# Altium schematic sheet Bank3-4-5_I_O 2.SchDoc
size A3
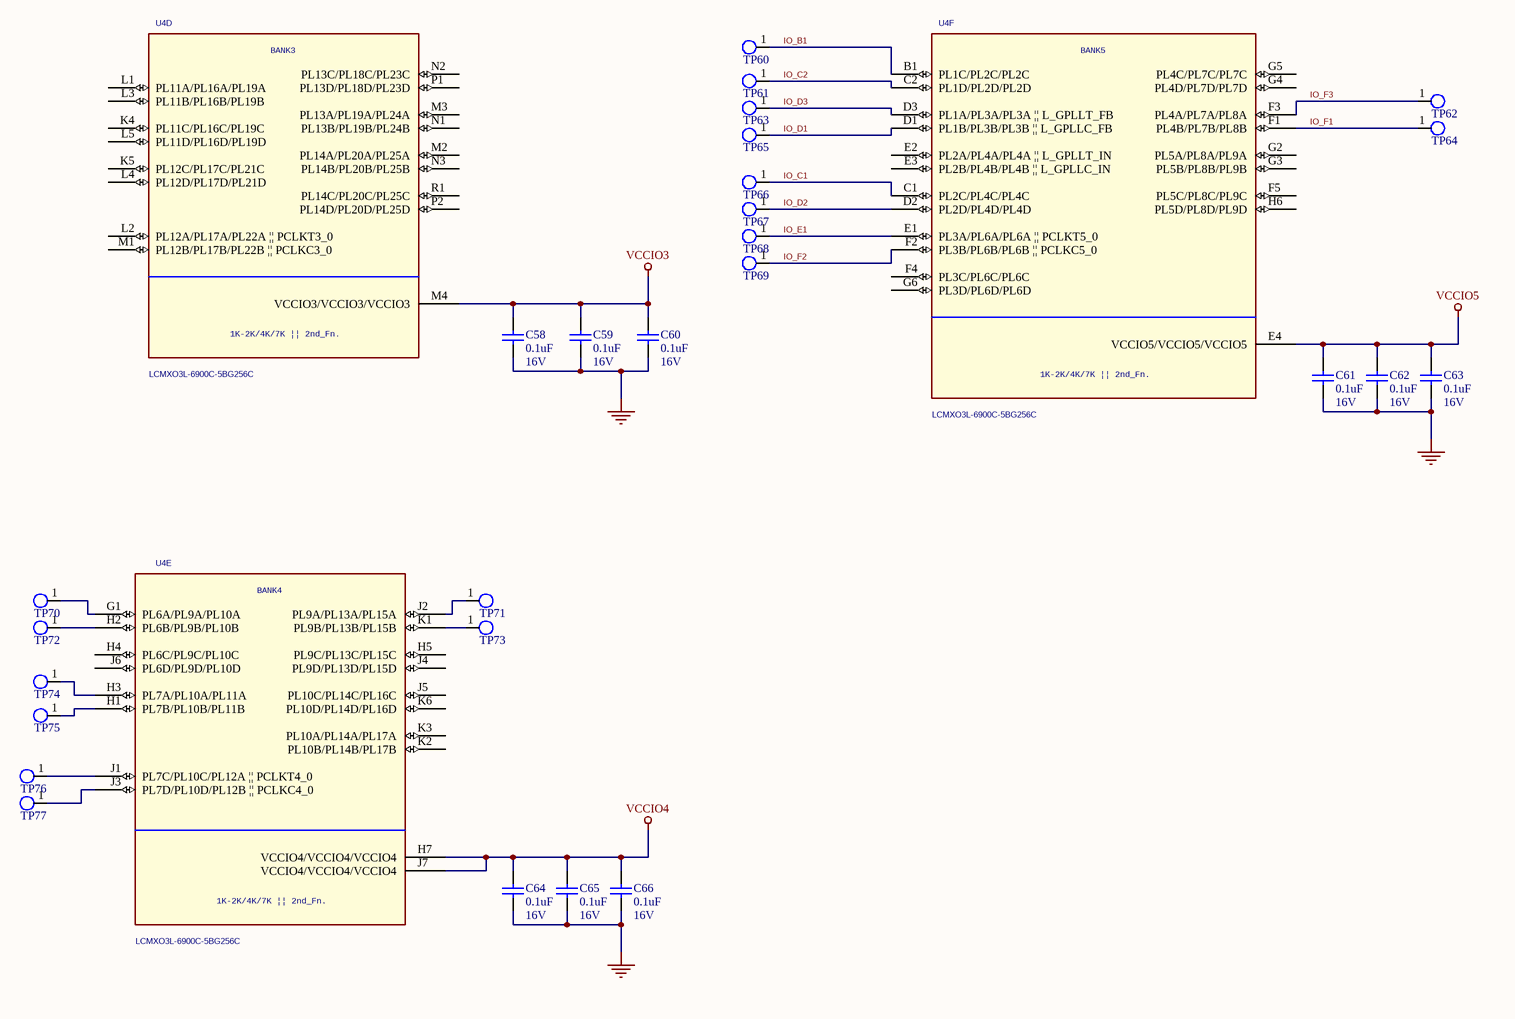
[diagram p0: Bank3-4-5_I_O 2.SchDoc]

## Parts
C58  value 0.1uF  Voltage: 16V  [CAPC1608X87X35ML15T15]  (hidden comment: C0603C104M4RACTU)
C59  value 0.1uF  Voltage: 16V  [CAPC1608X87X35ML15T15]  (hidden comment: C0603C104M4RACTU)
C60  value 0.1uF  Voltage: 16V  [CAPC1608X87X35ML15T15]  (hidden comment: C0603C104M4RACTU)
C61  value 0.1uF  Voltage: 16V  [CAPC1608X87X35ML15T15]  (hidden comment: C0603C104M4RACTU)
C62  value 0.1uF  Voltage: 16V  [CAPC1608X87X35ML15T15]  (hidden comment: C0603C104M4RACTU)
C63  value 0.1uF  Voltage: 16V  [CAPC1608X87X35ML15T15]  (hidden comment: C0603C104M4RACTU)
C64  value 0.1uF  Voltage: 16V  [CAPC1608X87X35ML15T15]  (hidden comment: C0603C104M4RACTU)
C65  value 0.1uF  Voltage: 16V  [CAPC1608X87X35ML15T15]  (hidden comment: C0603C104M4RACTU)
C66  value 0.1uF  Voltage: 16V  [CAPC1608X87X35ML15T15]  (hidden comment: C0603C104M4RACTU)
TP60  Test_Point_SMD  [Test_Point_SMD]  (value not drawn)
TP61  Test_Point_SMD  [Test_Point_SMD]  (value not drawn)
TP62  Test_Point_SMD  [Test_Point_SMD]  (value not drawn)
TP63  Test_Point_SMD  [Test_Point_SMD]  (value not drawn)
TP64  Test_Point_SMD  [Test_Point_SMD]  (value not drawn)
TP65  Test_Point_SMD  [Test_Point_SMD]  (value not drawn)
TP66  Test_Point_SMD  [Test_Point_SMD]  (value not drawn)
TP67  Test_Point_SMD  [Test_Point_SMD]  (value not drawn)
TP68  Test_Point_SMD  [Test_Point_SMD]  (value not drawn)
TP69  Test_Point_SMD  [Test_Point_SMD]  (value not drawn)
TP70  Test_Point_SMD  [Test_Point_SMD]  (value not drawn)
TP71  Test_Point_SMD  [Test_Point_SMD]  (value not drawn)
TP72  Test_Point_SMD  [Test_Point_SMD]  (value not drawn)
TP73  Test_Point_SMD  [Test_Point_SMD]  (value not drawn)
TP74  Test_Point_SMD  [Test_Point_SMD]  (value not drawn)
TP75  Test_Point_SMD  [Test_Point_SMD]  (value not drawn)
TP76  Test_Point_SMD  [Test_Point_SMD]  (value not drawn)
TP77  Test_Point_SMD  [Test_Point_SMD]  (value not drawn)
U4  LCMXO3L-6900C-5BG256C  [BGA256C80P16X16_1400X1400X170]  (parts D,E,F of 7)

## Nets
GND: C58.2 C59.2 C60.2 C61.2 C62.2 C63.2 C64.2 C65.2 C66.2
VCCIO3: C58.1 C59.1 C60.1 U4.M4(VCCIO3/VCCIO3/VCCIO3)
VCCIO4: C64.1 C65.1 C66.1 U4.H7(VCCIO4/VCCIO4/VCCIO4) U4.J7(VCCIO4/VCCIO4/VCCIO4)
VCCIO5: C61.1 C62.1 C63.1 U4.E4(VCCIO5/VCCIO5/VCCIO5)
IO_B1: TP60.1(TP) U4.B1(PL1C/PL2C/PL2C)
IO_C1: TP66.1(TP) U4.C1(PL2C/PL4C/PL4C)
IO_C2: TP61.1(TP) U4.C2(PL1D/PL2D/PL2D)
IO_D1: TP65.1(TP) U4.D1(PL1B/PL3B/PL3B_||_L_GPLLC_FB)
IO_D2: TP67.1(TP) U4.D2(PL2D/PL4D/PL4D)
IO_D3: TP63.1(TP) U4.D3(PL1A/PL3A/PL3A_||_L_GPLLT_FB)
IO_E1: TP68.1(TP) U4.E1(PL3A/PL6A/PL6A_||_PCLKT5_0)
IO_F1: TP64.1(TP) U4.F1(PL4B/PL7B/PL8B)
IO_F2: TP69.1(TP) U4.F2(PL3B/PL6B/PL6B_||_PCLKC5_0)
IO_F3: TP62.1(TP) U4.F3(PL4A/PL7A/PL8A)
NetTP70_1: TP70.1(TP) U4.G1(PL6A/PL9A/PL10A)
NetTP71_1: TP71.1(TP) U4.J2(PL9A/PL13A/PL15A)
NetTP72_1: TP72.1(TP) U4.H2(PL6B/PL9B/PL10B)
NetTP73_1: TP73.1(TP) U4.K1(PL9B/PL13B/PL15B)
NetTP74_1: TP74.1(TP) U4.H3(PL7A/PL10A/PL11A)
NetTP75_1: TP75.1(TP) U4.H1(PL7B/PL10B/PL11B)
NetTP76_1: TP76.1(TP) U4.J1(PL7C/PL10C/PL12A_||_PCLKT4_0)
NetTP77_1: TP77.1(TP) U4.J3(PL7D/PL10D/PL12B_||_PCLKC4_0)

Not connected (* = marked no-connect by the designer): U4 E2(PL2A/PL4A/PL4A_||_L_GPLLT_IN) E3(PL2B/PL4B/PL4B_||_L_GPLLC_IN) F4(PL3C/PL6C/PL6C) F5(PL5C/PL8C/PL9C) G2(PL5A/PL8A/PL9A) G3(PL5B/PL8B/PL9B) G4(PL4D/PL7D/PL7D) G5(PL4C/PL7C/PL7C) G6(PL3D/PL6D/PL6D) H4(PL6C/PL9C/PL10C) H5(PL9C/PL13C/PL15C) H6(PL5D/PL8D/PL9D) J4(PL9D/PL13D/PL15D) J5(PL10C/PL14C/PL16C) J6(PL6D/PL9D/PL10D) K2(PL10B/PL14B/PL17B) K3(PL10A/PL14A/PL17A) K4(PL11C/PL16C/PL19C) K5(PL12C/PL17C/PL21C) K6(PL10D/PL14D/PL16D) L1(PL11A/PL16A/PL19A) L2(PL12A/PL17A/PL22A_||_PCLKT3_0) L3(PL11B/PL16B/PL19B) L4(PL12D/PL17D/PL21D) L5(PL11D/PL16D/PL19D) M1(PL12B/PL17B/PL22B_||_PCLKC3_0) M2(PL14A/PL20A/PL25A) M3(PL13A/PL19A/PL24A) N1(PL13B/PL19B/PL24B) N2(PL13C/PL18C/PL23C) N3(PL14B/PL20B/PL25B) P1(PL13D/PL18D/PL23D) P2(PL14D/PL20D/PL25D) R1(PL14C/PL20C/PL25C)

## Notes on the sheet
- Title
- Size:
- Date:
- A3
- Number:
- Time:
- Revision:
- Sheet
- of
- File:
- (in symbol LCMXO3L-1K/2K/4K/7K-BG256, part D) BANK3; 1K-2K/4K/7K || 2nd_Fn.
- (in symbol LCMXO3L-1K/2K/4K/7K-BG256, part E) BANK4; 1K-2K/4K/7K || 2nd_Fn.
- (in symbol LCMXO3L-1K/2K/4K/7K-BG256, part F) BANK5; 1K-2K/4K/7K || 2nd_Fn.

## Library data of the parts
C58-C66 = CMP-2006-03067-1: Ceramic Capacitor 0.1uF 16V +-10% X7R0603; Manufacturer: Kemet; Alternative1: C1608X7R1E104K TDK; Alternative2: CC0603KRX7R8BB104 Yageo; Alternative3: GRM188R72A104KA35D Murata; Part Number: C0603C104M4RACTU; Package / Case: 0603
U4 = LCMXO3L-1K/2K/4K/7K-BG256: IC FPGA 6864LUTS 256BGA; Manufacturer: Lattice semi; Source Part: LCMXO3L-1K/2K/4K/7K-BG256A.Normal; SPLIT_INST: TRUE; SWAP_INFO: (S1+S2+S3+S4+S5+S6+S7); Name: I16790692; Primitive: DEFAULT; Implementation Type: <none>; Location X-Coordinate: 0; Source Library: D:\DESIGN_DOC\XO3\LATTICEORCADCAPTURESCHEMATICLIBRARYOLB\LATTICEORCADCAPTURESCHEMATICLIBRARYOLB\LATTICE_SYM\LATTICEPLDS.OLB; Power Pins Visible: False; Digikey P/N: 220-1886-ND; Location Y-Coordinate: 0; Color: Default; Source Package: LCMXO3L-1K/2K/4K/7K-BG256; Graphic: LCMXO3L-1K/2K/4K/7K-BG256A.Normal; Manufacturer Part Number: LCMXO3L-6900C-5BG256C